# EAGLE schematic rfid_v1 (EAGLE 6.5.0)
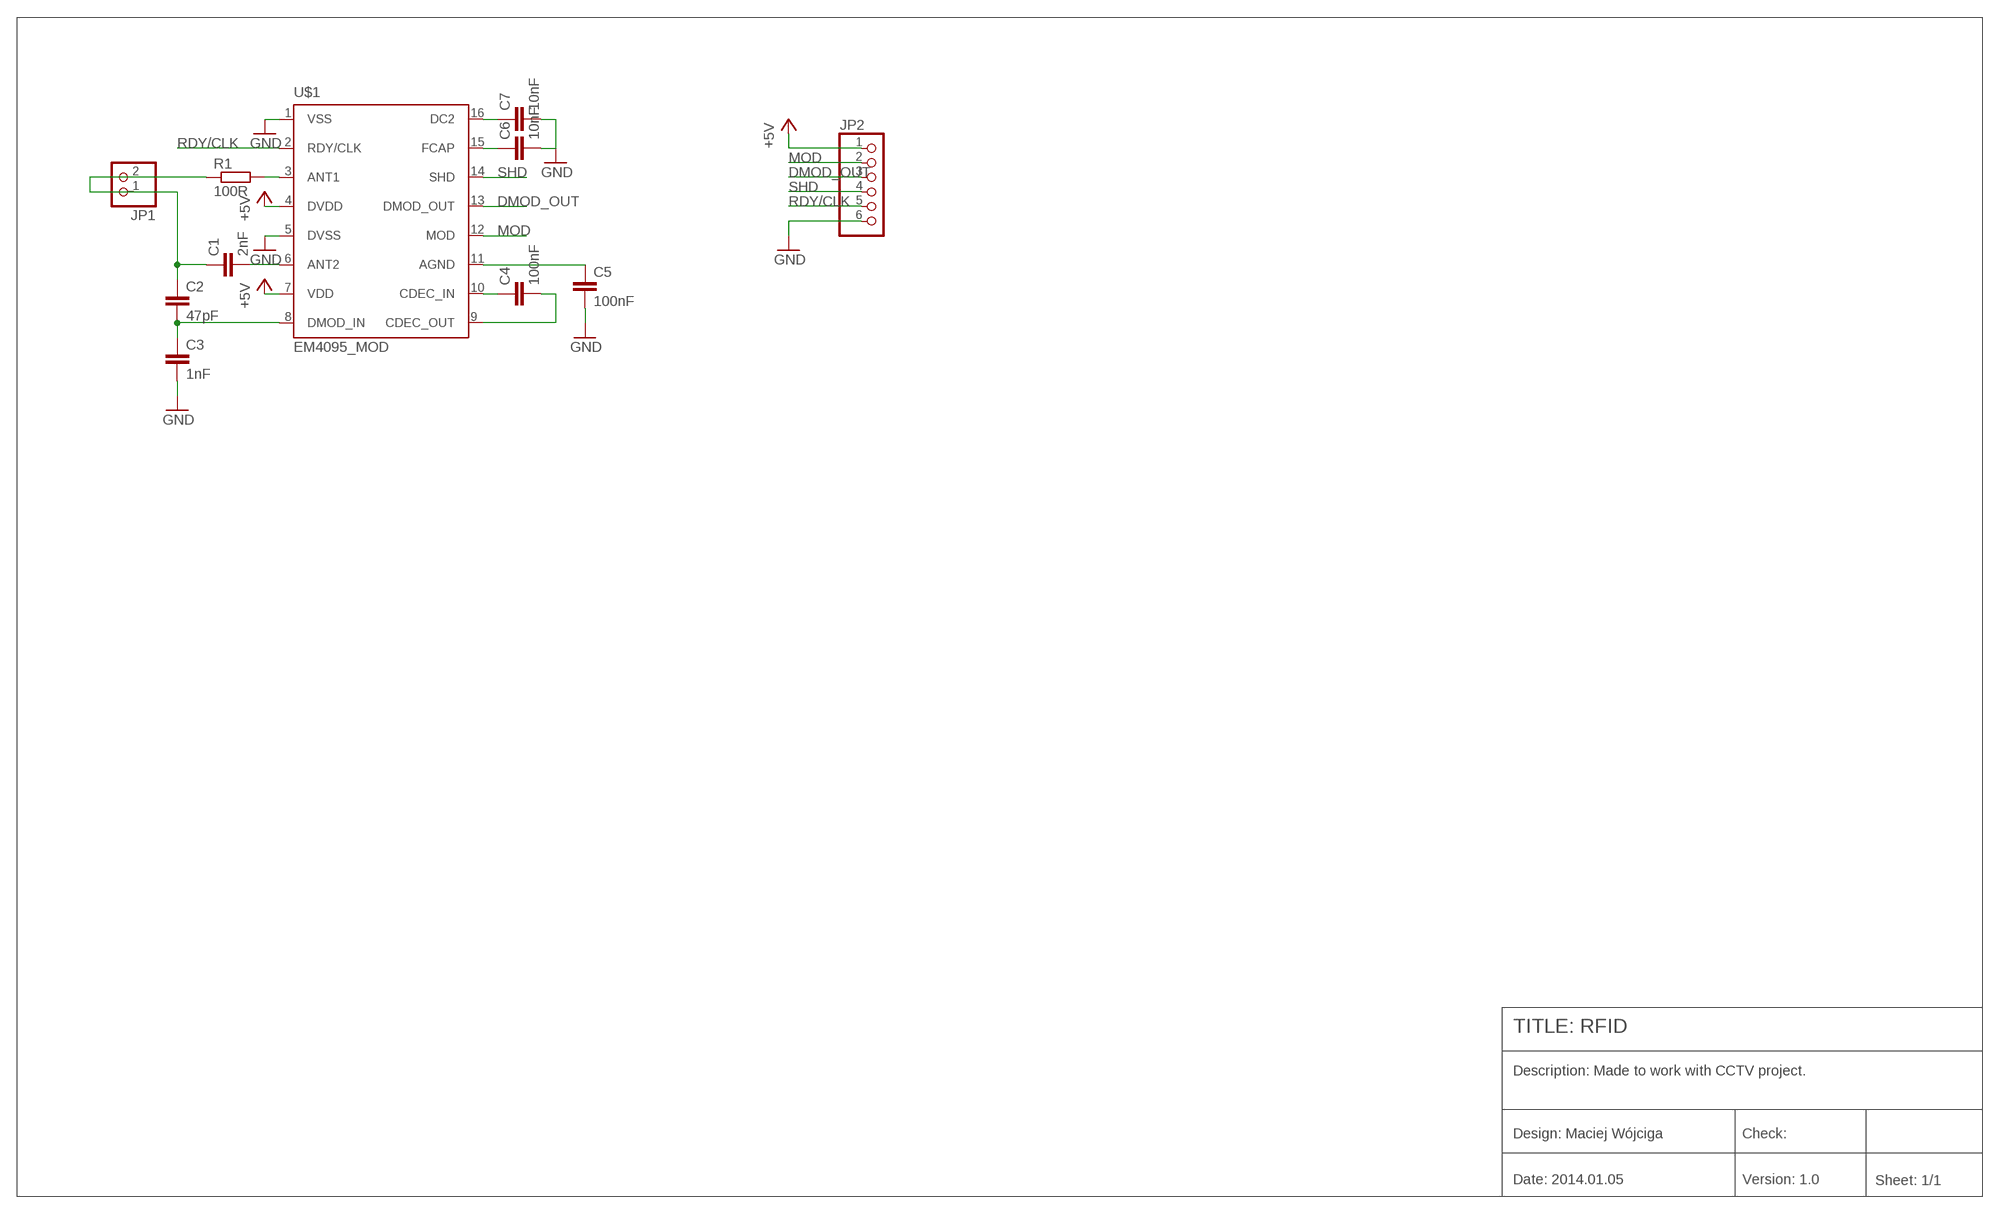
[diagram p0: schematic, sheet 1]

## Parts
C1  2nF  C-EU025-024X044  [C025-024X044]
C2  47pF  C-EU025-024X044  [C025-024X044]
C3  1nF  C-EU025-024X044  [C025-024X044]
C4  100nF  C-EU025-024X044  [C025-024X044]
C5  100nF  C-EU025-024X044  [C025-024X044]
C6  10nF  C-EU025-024X044  [C025-024X044]
C7  10nF  C-EU025-024X044  [C025-024X044]
JP1  PINHD-1X2  [1X02]
JP2  PINHD-1X6/90  [1X06/90]
R1  100R  R-EU_0207/10  [0207/10]
U$1  EM4095_MOD  [SO16]

## Nets
+5V: JP2.1 U$1.4(DVDD) U$1.7(VDD)
DMOD_OUT: JP2.3 U$1.13(DMOD_OUT)
GND: C3.2 C5.2 C6.2 C7.2 JP2.6 U$1.1(VSS) U$1.5(DVSS)
MOD: JP2.2 U$1.12(MOD)
N$1: C2.2 C3.1 U$1.8(DMOD_IN)
N$2: C1.2 U$1.6(ANT2)
N$4: R1.2 U$1.3(ANT1)
N$5: C1.1 C2.1 JP1.1 JP1.2 R1.1
N$6: C4.1 U$1.10(CDEC_IN)
N$7: C4.2 U$1.9(CDEC_OUT)
N$8: C5.1 U$1.11(AGND)
N$12: C7.1 U$1.16(DC2)
N$13: C6.1 U$1.15(FCAP)
RDY/CLK: JP2.5 U$1.2(RDY/CLK)
SHD: JP2.4 U$1.14(SHD)

## Notes on the sheet
- TITLE: RFID
- Description: Made to work with CCTV project.
- Design: Maciej Wójciga | Check:
- Date: 2014.01.05 | Version: 1.0 | Sheet: 1/1

## Library data of the parts
C1-C7 = rcl:C-EU: CAPACITOR, European symbol
JP1 = pinhead:PINHD-1X2: PIN HEADER
JP2 = pinhead:PINHD-1X6: PIN HEADER
R1 = rcl:R-EU_: RESISTOR, European symbol
U$1 = em-microelectronic:EM4095_MOD: Read/Write analog front end for 125kHz RFID Basestation Source: http://www.emmicroelectronic.com/webfiles/Product/RFID/DS/EM4095_DS.pdf Modified by mwojciga Technologies Attributes EM4095